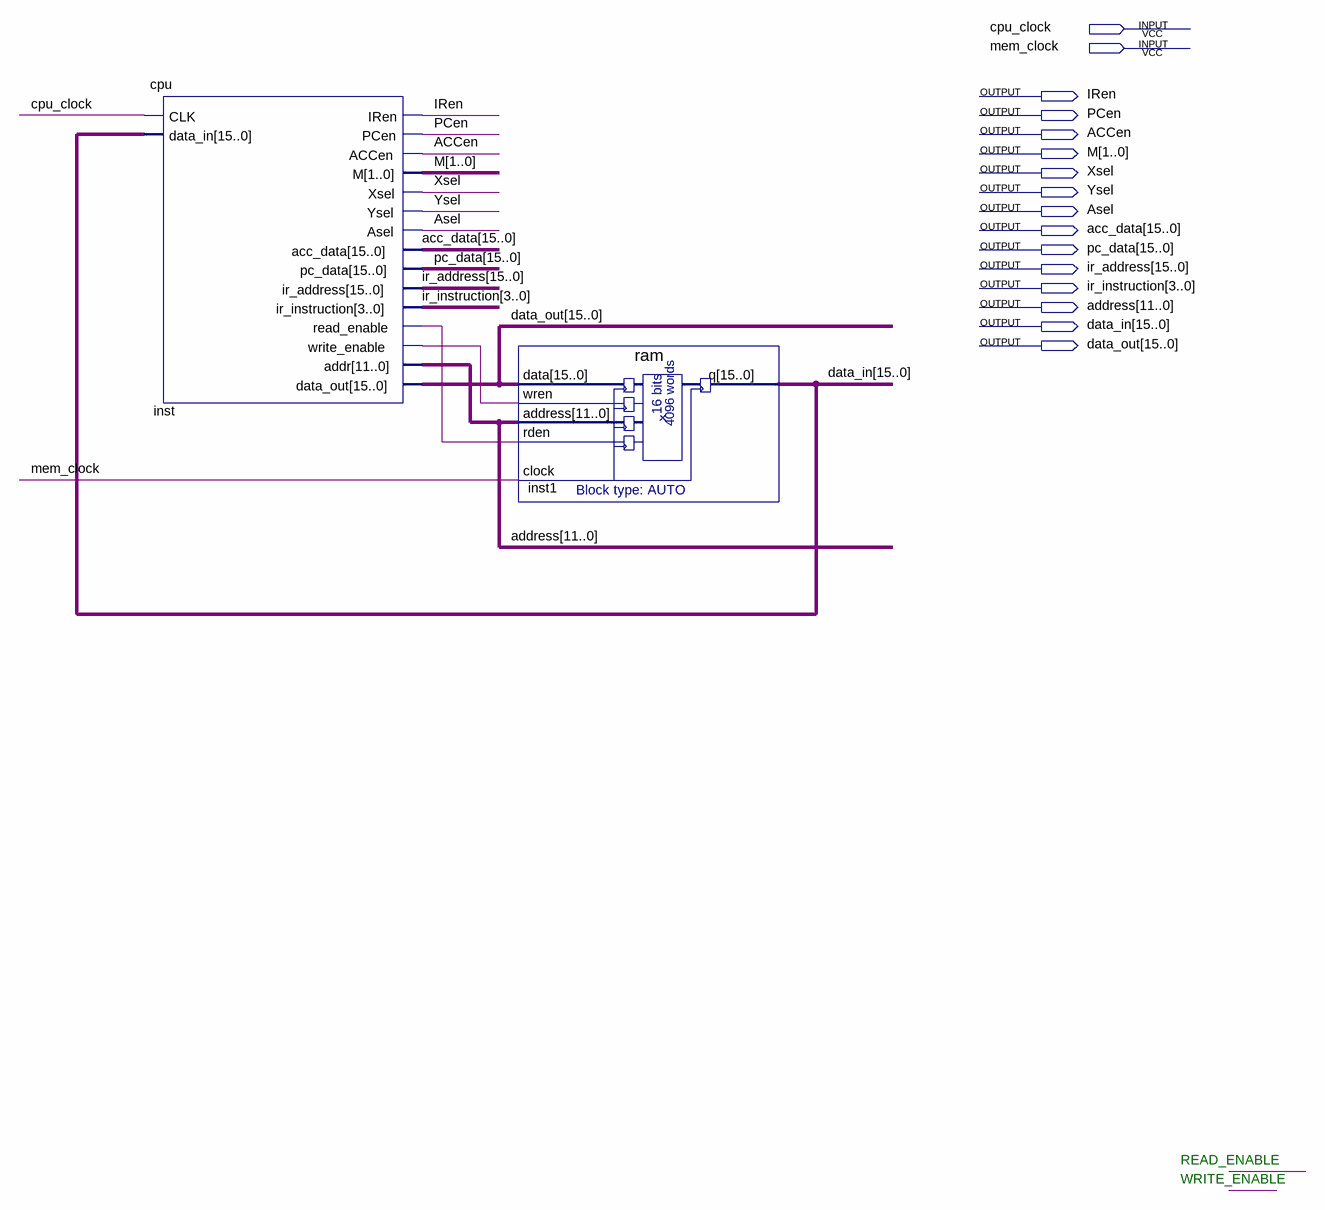
[diagram p0: schematic sheet]
// Quartus schematic mu0.bdf as structural Verilog: 2 symbols, 16 pins
module mu0 (
  input  cpu_clock,
  input  mem_clock,
  output IRen,
  output PCen,
  output ACCen,
  output [1:0] M,
  output Xsel,
  output Ysel,
  output Asel,
  output [15:0] acc_data,
  output [15:0] pc_data,
  output [15:0] ir_address,
  output [3:0] ir_instruction,
  output [11:0] address,
  output [15:0] data_in,
  output [15:0] data_out
);

  wire inst_read_enable, inst_write_enable;

  cpu inst (
    .CLK(cpu_clock), .data_in(data_in), .IRen(IRen), .PCen(PCen), .ACCen(ACCen), .M(M), .Xsel(Xsel),
    .Ysel(Ysel), .Asel(Asel), .acc_data(acc_data), .pc_data(pc_data), .ir_address(ir_address),
    .ir_instruction(ir_instruction), .read_enable(inst_read_enable), .write_enable(inst_write_enable),
    .addr(address), .data_out(data_out));
  ram inst1 (
    .data(data_out), .wren(inst_write_enable), .address(address), .rden(inst_read_enable), .clock(mem_clock),
    .q(data_in));

  // Notes on the sheet:
  //   READ_ENABLE
  //   WRITE_ENABLE
endmodule
